# EAGLE design d2101-lofi-delay (EAGLE 7.4.1)
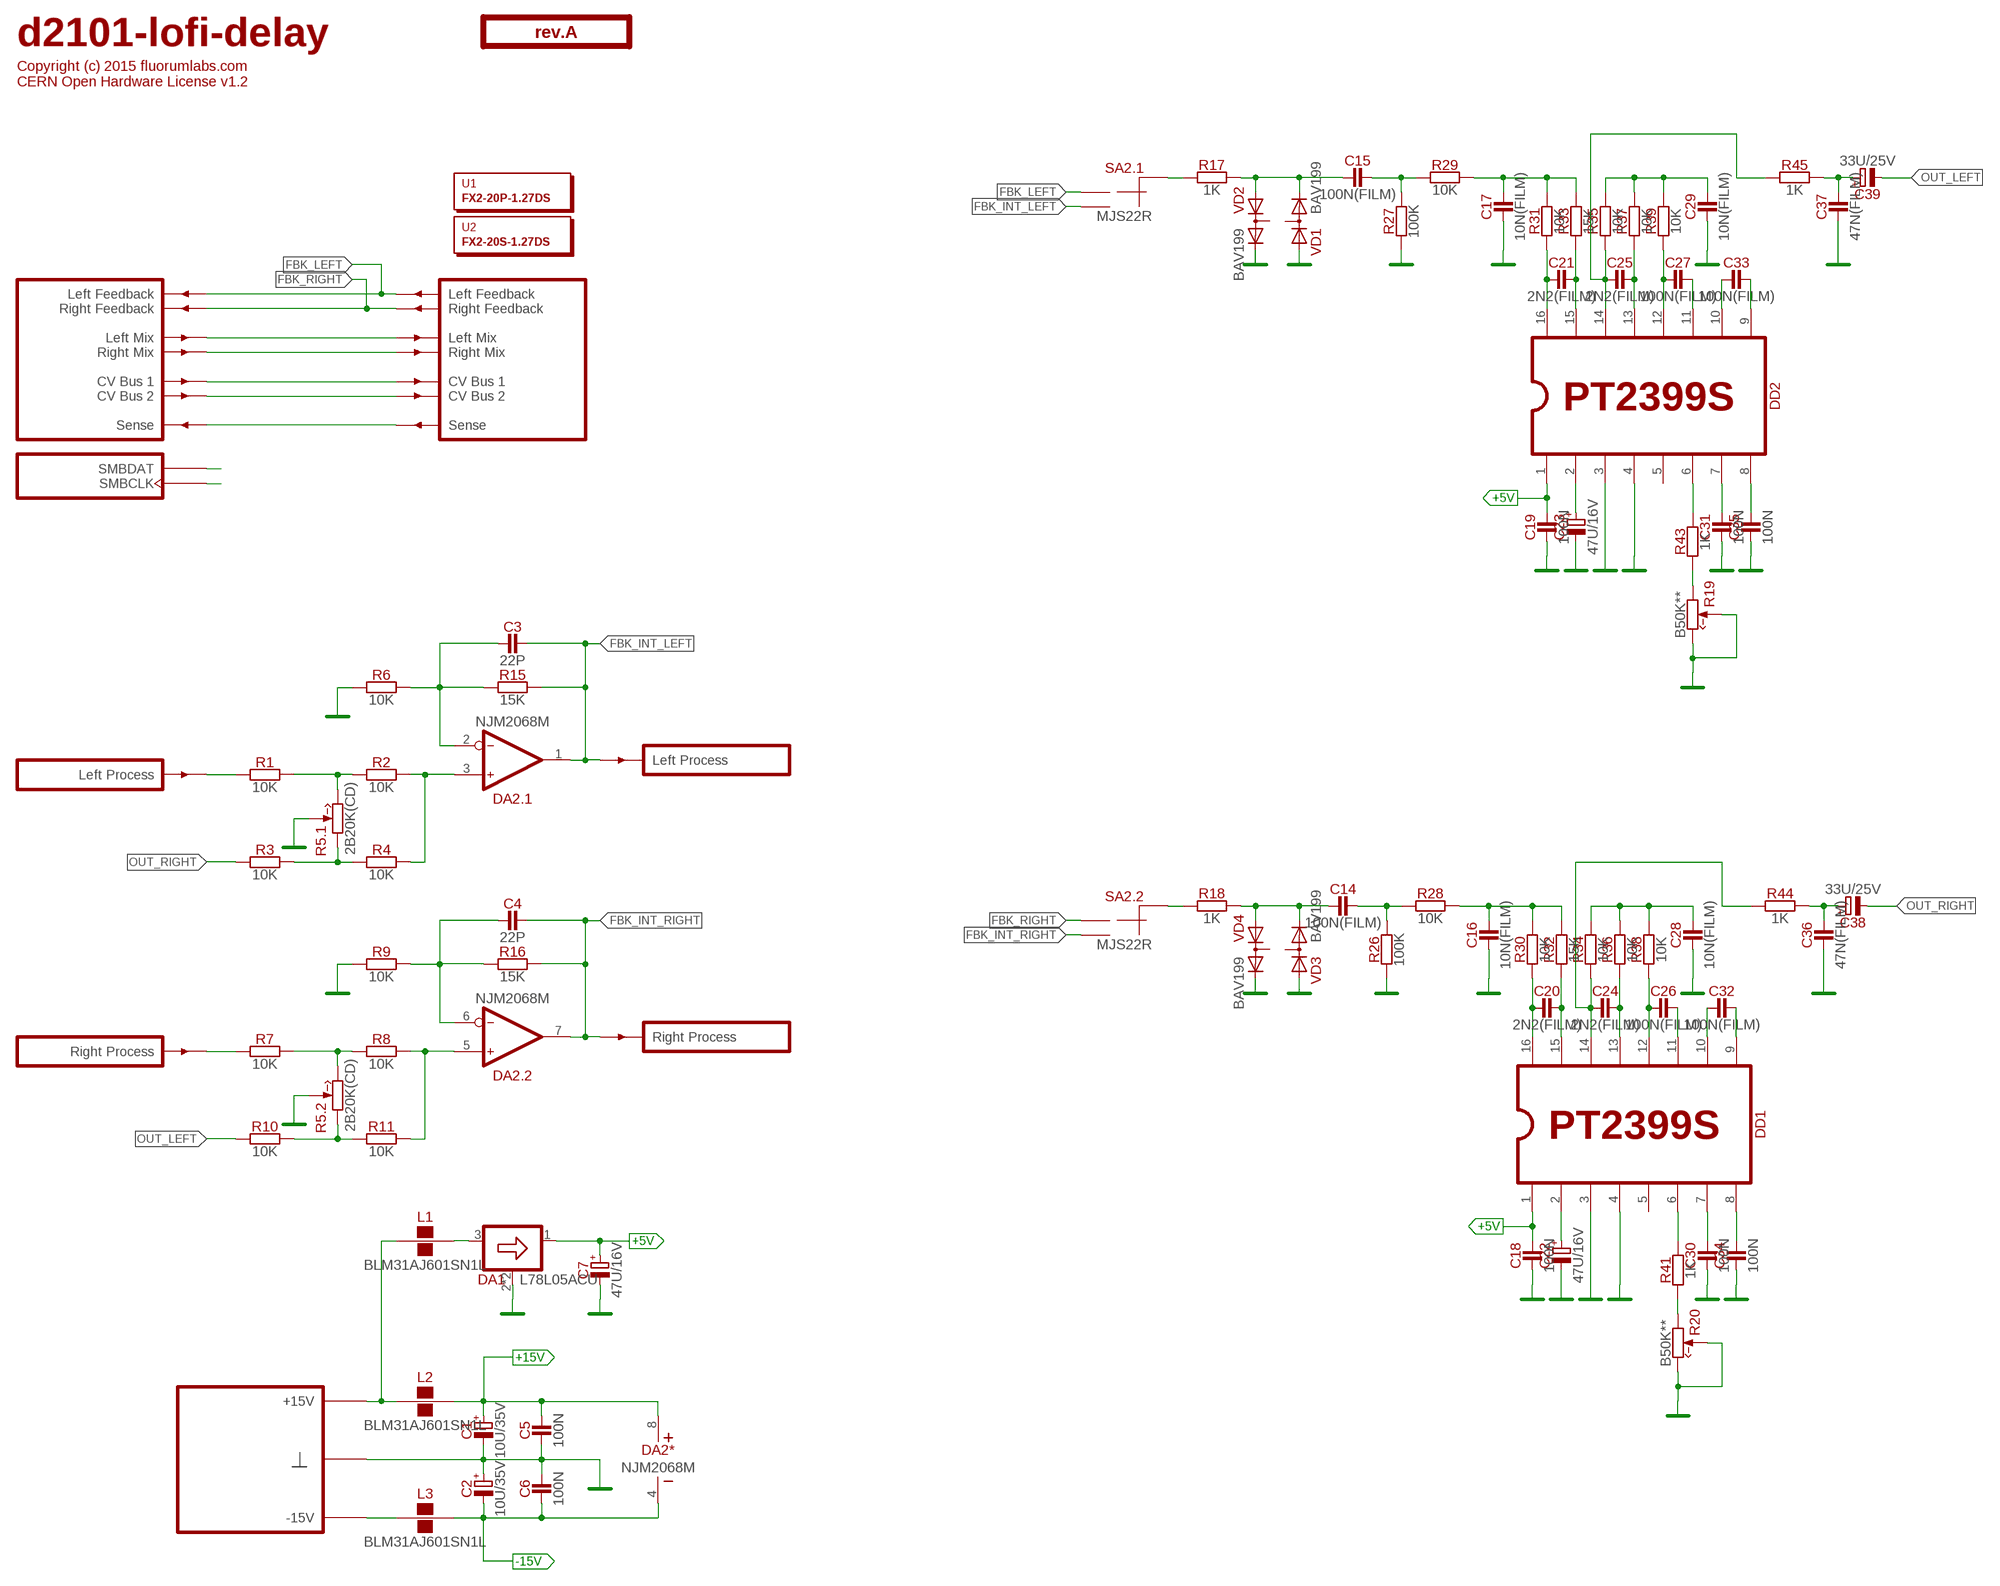
[diagram p0: schematic, sheet 1]

## Parts
C1  10U/35V  [E2-5]
C2  10U/35V  [E2-5]
C3  22P  [C-0805]
C4  22P  [C-0805]
C5  100N  [C-0805]
C6  100N  [C-0805]
C7  47U/16V  [E2-5]
C14  100N(FILM)  [C050-025X075]
C15  100N(FILM)  [C050-025X075]
C16  10N(FILM)  [C050-025X075]
C17  10N(FILM)  [C050-025X075]
C18  100N  [C-0805]
C19  100N  [C-0805]
C20  2N2(FILM)  [C050-025X075]
C21  2N2(FILM)  [C050-025X075]
C22  47U/16V  [E2-5]
C23  47U/16V  [E2-5]
C24  2N2(FILM)  [C050-025X075]
C25  2N2(FILM)  [C050-025X075]
C26  100N(FILM)  [C050-025X075]
C27  100N(FILM)  [C050-025X075]
C28  10N(FILM)  [C050-025X075]
C29  10N(FILM)  [C050-025X075]
C30  100N  [C-0805]
C31  100N  [C-0805]
C32  100N(FILM)  [C050-025X075]
C33  100N(FILM)  [C050-025X075]
C34  100N  [C-0805]
C35  100N  [C-0805]
C36  47N(FILM)  [C050-025X075]
C37  47N(FILM)  [C050-025X075]
C38  33U/25V  [E2,5-7]
C39  33U/25V  [E2,5-7]
DA1  L78L05ACU  [SOT89]
DA2  NJM2068M  [SO-8]
DD1  PT2399S  [SO-16]
DD2  PT2399S  [SO-16]
L1  BLM31AJ601SN1L  [1206]
L2  BLM31AJ601SN1L  [1206]
L3  BLM31AJ601SN1L  [1206]
O1  TITLE  [EMPTY]
PCB1  rev.A  ST2-BOARD-50  [ST2-BOARD-50]
R1  10K  [R-0805]
R2  10K  [R-0805]
R3  10K  [R-0805]
R4  10K  [R-0805]
R5  2B20K(CD)  [RV11-DUAL]
R6  10K  [R-0805]
R7  10K  [R-0805]
R8  10K  [R-0805]
R9  10K  [R-0805]
R10  10K  [R-0805]
R11  10K  [R-0805]
R15  15K  [R-0805]
R16  15K  [R-0805]
R17  1K  [R-0805]
R18  1K  [R-0805]
R19  B50K**  [RV11-SINGLE]
R20  B50K**  [RV11-SINGLE]
R26  100K  [R-0805]
R27  100K  [R-0805]
R28  10K  [R-0805]
R29  10K  [R-0805]
R30  10K  [R-0805]
R31  10K  [R-0805]
R32  15K  [R-0805]
R33  15K  [R-0805]
R34  10K  [R-0805]
R35  10K  [R-0805]
R36  10K  [R-0805]
R37  10K  [R-0805]
R38  10K  [R-0805]
R39  10K  [R-0805]
R41  1K  [R-0805]
R43  1K  [R-0805]
R44  1K  [R-0805]
R45  1K  [R-0805]
SA2  MJS22R  [APEM-MJS22R]
U1  FX2-20P-1.27DS  [EMPTY]
U2  FX2-20S-1.27DS  [EMPTY]
VD1  BAV199  [SOT23]
VD2  BAV199  [SOT23]
VD3  BAV199  [SOT23]
VD4  BAV199  [SOT23]

## Nets
+5V: C7.+ C18.2 C19.2 DA1.1(OUT) DD1.1 DD2.1
+15V [power]: C1.+ C5.2 DA2.8(*:V+) L2.2
-15V [power]: C2.- C6.1 DA2.4(*:V-) L3.2
FBK_INT_LEFT: C3.2 DA2.1(.1:OUT) PCB1.BOUTL'(OUTL) R15.2 SA2.NO1
FBK_INT_RIGHT: C4.2 DA2.7(.2:OUT) PCB1.BOUTR'(OUTR) R16.2 SA2.NO2
FBK_LEFT: PCB1.ALFBK'(LFBK') PCB1.ALFBK(LFBK) SA2.NC1
FBK_RIGHT: PCB1.ARFBK'(RFBK') PCB1.ARFBK(RFBK) SA2.NC2
GND: C1.- C2.+ C5.1 C6.2 C7.- C16.1 C17.1 C18.1 C19.1 C22.- C23.- C28.1 C29.1 C30.1 C31.1 C34.1 C35.1 C36.1 C37.1 DA1.2(GND) DA1.2@1(GND) DD1.3 DD1.4 DD2.3 DD2.4 PCB1.B4'(GND) PCB1.B4(GND) PCB1.B5'(GND) PCB1.B5(GND) PCB1.B6'(GND) PCB1.B6(GND) PCB1.B7'(GND) PCB1.B7(GND) PCB1.B8'(GND) PCB1.B8(GND) R5.2'(.2:W) R5.2(.1:W) R6.1 R9.1 R19.2(W) R19.3(CW) R20.2(W) R20.3(CW) R26.1 R27.1 VD1.1(A) VD2.2(C) VD3.1(A) VD4.2(C)
LMIX: PCB1.ALMIX'(LMIX') PCB1.ALMIX(LMIX)
N$1: R19.1(CCW) R43.1
N$2: R20.1(CCW) R41.1
N$3: C15.1 R17.2 VD1.2(C) VD2.1(A)
N$4: C21.1 DD2.16 R31.1
N$5: C14.1 R18.2 VD3.2(C) VD4.1(A)
N$6: R17.1 SA2.C1(.1:CM)
N$7: R5.3'(.2:CW) R7.2 R8.1
N$9: C15.2 R27.2 R29.1
N$10: C17.2 R29.2 R31.2 R33.2
N$11: PCB1.BINL(INL) R1.1
N$13: R18.1 SA2.C2(.2:CM)
N$15: C29.2 R35.2 R37.2 R39.2
N$16: PCB1.BSENSE'(SENSE') PCB1.BSENSE(SENSE)
N$17: C21.2 DD2.15 R33.1
N$18: C25.1 DD2.14 R35.1 R45.1
N$19: C25.2 DD2.13 R37.1
N$20: C27.1 DD2.12 R39.1
N$21: C27.2 DD2.11
N$22: C33.1 DD2.10
N$23: C33.2 DD2.9
N$24: C37.2 C39.+ R45.2
N$25: C4.1 DA2.6(.2:IN-) R9.2 R16.1
N$28: PCB1.BINR(INR) R7.1
N$30: R1.2 R2.1 R5.3(.1:CW)
N$31: C31.2 DD2.7
N$32: C35.2 DD2.8
N$33: DD2.6 R43.2
N$36: L3.1 PCB1.A-15'(P-15V) PCB1.A-15(P-15V) PCB1.B-15'(P-15V) PCB1.B-15(P-15V)
N$37: C23.+ DD2.2
N$38: PCB1.ASMBDAT'(SMBDAT) PCB1.ASMBDAT(SMBDAT)
N$39: DA2.5(.2:IN+) R8.2 R11.2
N$40: R5.1'(.2:CCW) R10.2 R11.1
N$41: PCB1.ACV1'(CV1') PCB1.ACV1(CV1)
N$42: PCB1.ACV2'(CV2') PCB1.ACV2(CV2)
N$43: PCB1.ASMBCLK'(SMBCLK) PCB1.ASMBCLK(SMBCLK)
N$44: DA1.3(IN) L1.2
N$48: C28.2 R34.2 R36.2 R38.2
N$49: C20.1 DD1.16 R30.1
N$50: C20.2 DD1.15 R32.1
N$51: C24.1 DD1.14 R34.1 R44.1
N$52: C24.2 DD1.13 R36.1
N$53: C26.1 DD1.12 R38.1
N$54: C26.2 DD1.11
N$55: C32.1 DD1.10
N$56: C32.2 DD1.9
N$57: C36.2 C38.+ R44.2
N$58: C30.2 DD1.7
N$59: C34.2 DD1.8
N$60: DD1.6 R41.2
N$61: DA2.3(.1:IN+) R2.2 R4.2
N$62: C14.2 R26.2 R28.1
N$63: C16.2 R28.2 R30.2 R32.2
N$64: C3.1 DA2.2(.1:IN-) R6.2 R15.1
N$65: R3.2 R4.1 R5.1(.1:CCW)
N$69: C22.+ DD1.2
OUT_LEFT: C39.- R10.1
OUT_RIGHT: C38.- R3.1
P+15V: L1.1 L2.1 PCB1.A+15'(P+15V) PCB1.A+15(P+15V) PCB1.B+15'(P+15V) PCB1.B+15(P+15V)
RMIX: PCB1.ARMIX'(RMIX') PCB1.ARMIX(RMIX)
Unconnected: DD1.5 DD2.5 VD1.3(CMN) VD2.3(CMN) VD3.3(CMN) VD4.3(CMN)

## Library data of the parts
C1 C2 = capacitors-electrolytic:?; MOUSER: 647-USW1V100MDD
C3 C4 = capacitors:?; MOUSER: 77-VJ0805A220GXACBC
C5 C6 C18 C19 C30 C31 C34 C35 = capacitors:?; MOUSER: 77-VJ0805V104MXBPBC
C7 C22 C23 = capacitors-electrolytic:?; MOUSER: 647-USW1C470MDD
C14 C15 C26 C27 C32 C33 = capacitors:?; MOUSER: 505-MKS2.1/63/5
C16 C17 C28 C29 = capacitors:?; MOUSER: 80-F622JF103J100C
C20 C21 C24 C25 = capacitors:?; MOUSER: 80-PHE426DJ4220JR05
C36 C37 = capacitors:?; MOUSER: 871-B32529C1473J
C38 C39 = capacitors-electrolytic:?
DA1 = regulators-linear:?; MOUSER: 511-L78L05ACU
DA2 = ic-jrc:NJM2068; MOUSER: 513-NJM2068M
DD1 DD2 = ic-princeton-technologies:PT2399; PARTNO: *
L1-L3 = inductors:BLM31AJ601SN1L; MOUSER: 81-BLM31AJ601SN1L
O1 = text:TITLE
PCB1 = module-footprints:ST2-BOARD-50
R1-R4 R6-R11 R28-R31 R34-R39 = resistors:?; MOUSER: 660-RK73H2ATTD1002F
R5 = potentiometers:2**?; MOUSER: 688-RK12L1230C1M
R15 R16 R32 R33 = resistors:?; MOUSER: 660-RK73H2ATTD1502F
R17 R18 R41 R43-R45 = resistors:?; MOUSER: 660-RK73H2ATTD1001F
R19 R20 = potentiometers:?; MOUSER: 652-PTV111-3415AB503
R26 R27 = resistors:?; MOUSER: 660-RK73H2ATTD1003F
SA2 = switches:MJS22R; MOUSER: 642-MJS22R
U1 = hardware:?; MOUSER: 798-FX2-20P-1.27DS71
U2 = hardware:?; MOUSER: 798-FX2-20S-1.27DS71
VD1-VD4 = diodes:BAV199; MOUSER: 771-BAV199-T/R

## Board
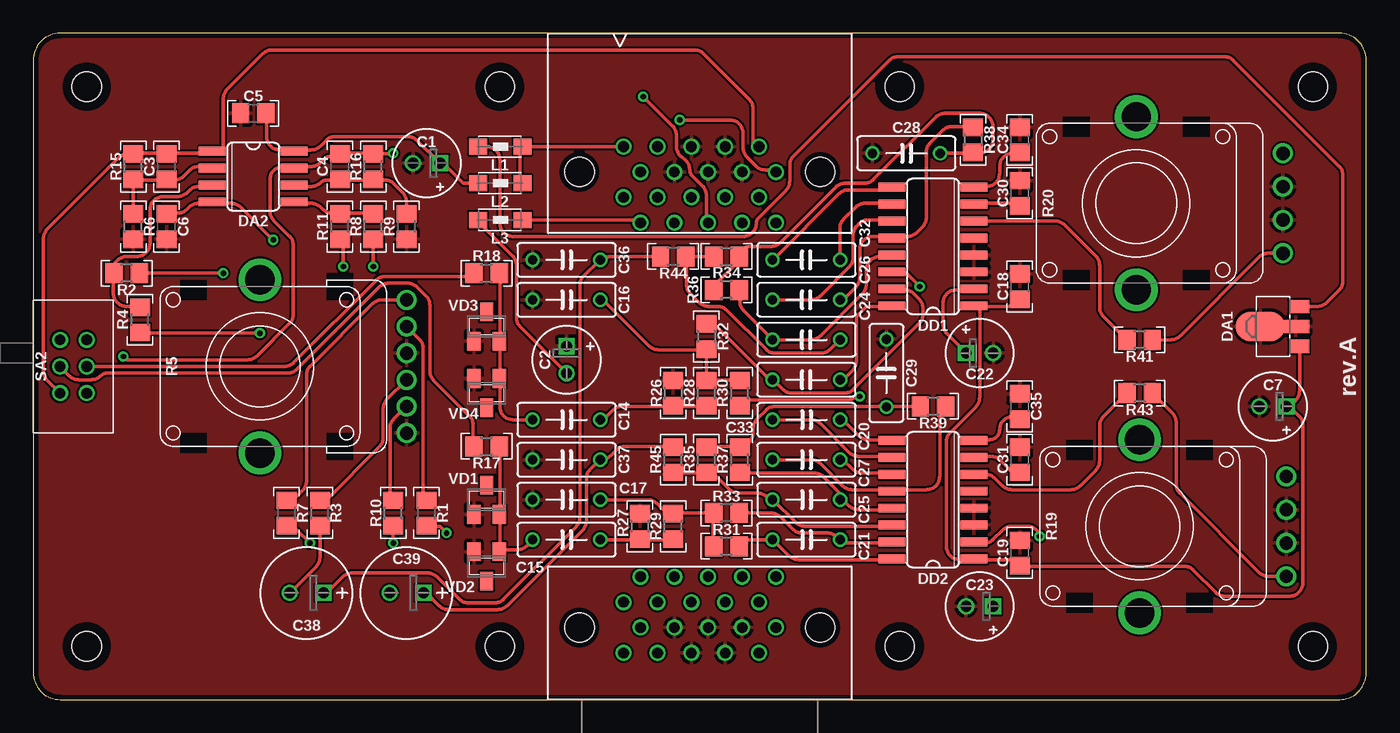
[diagram p1: board, top side]
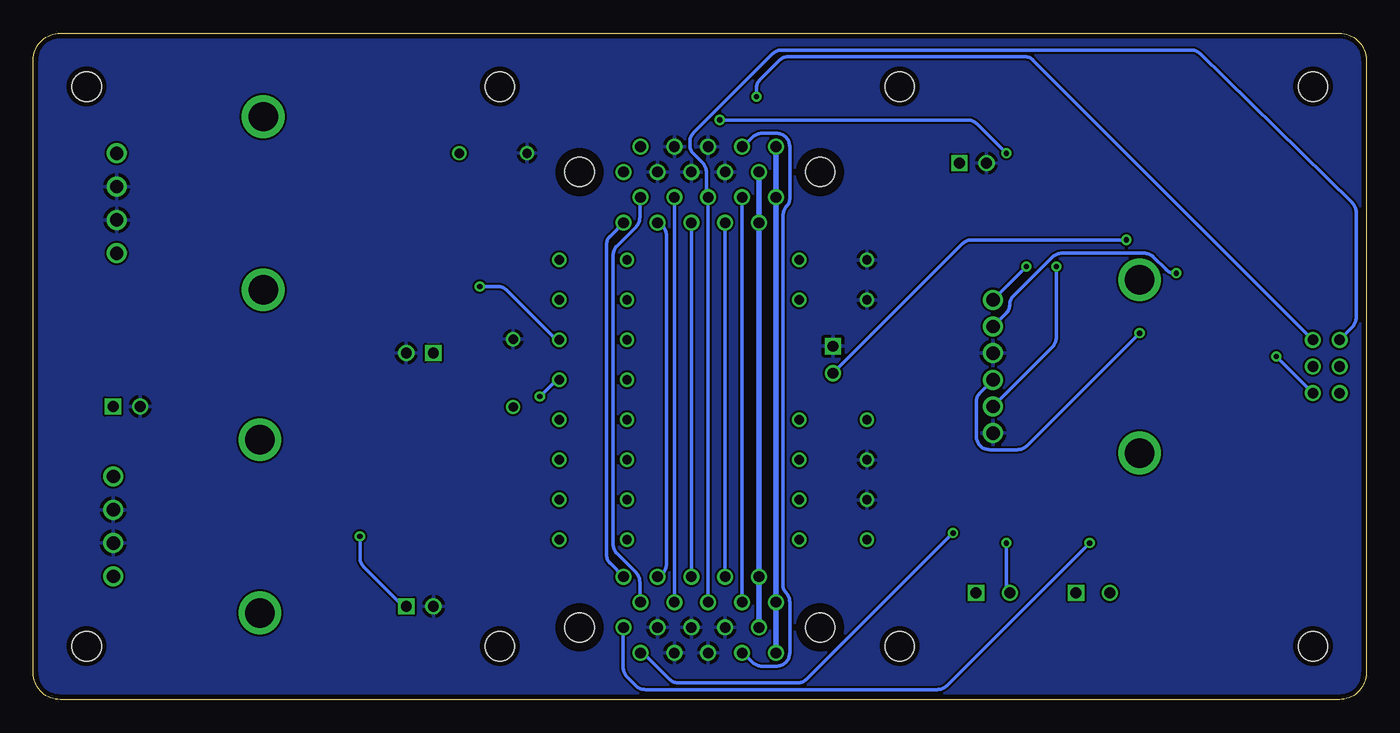
[diagram p2: board, bottom side, seen from below]

Size 100 x 50 mm. Coordinates in mm from the lower left corner, seen from the top.
Outline: 0,48 0,2 arc90 2,0 98,0 arc90 100,2 100,48 arc90 98,50 2,50 arc90 0,48
Copper layers (1*16): Top 0.0356mm / dielectric 1.5011mm / Bottom 0.0356mm
Design rules "LaenPCBOrder": minimum track width 6mil, minimum drill 13mil, track to track 6mil, track to pad 6mil, pad to pad 6mil, via to via 6mil, smd to smd 6mil, copper to edge 15mil, drill to drill 6mil, minimum pad ring 7mil, minimum via ring 7mil, stop-mask expansion 3mil, vias tented up to drill 0mil, thermal gap 10mil

### Footprints (pad centres in the part's own frame; a part is rotated, then mirrored left to right if it is on the bottom)
E2-5 = drill 0.813 square: + -1.016,0 | drill 0.813: - 1.016,0
C-0805 = smd 1.3 x 1.5: 1 -0.95,0; 2 0.95,0
C050-025X075 = drill 0.7: 1 -2.54,0; 2 2.54,0
E2,5-7 = drill 0.813 square: + -1.27,0 | drill 0.813: - 1.27,0
SOT89 = smd 1 x 1.5: 1 -1.499,-1.981; 3 1.499,-1.981 | smd 1 x 2: 2 0,-1.727 | smd 2.2 x 3.7: 2@1 0,0.94
SO-8 = smd 0.66 x 2.032: 1 -1.905,-3.073; 2 -0.635,-3.073; 3 0.635,-3.073; 4 1.905,-3.073; 5 1.905,3.073; 6 0.635,3.073; 7 -0.635,3.073; 8 -1.905,3.073
SO-16 = smd 0.66 x 2.032: 1 -4.445,-3.073; 2 -3.175,-3.073; 3 -1.905,-3.073; 4 -0.635,-3.073; 5 0.635,-3.073; 6 1.905,-3.073; 7 3.175,-3.073; 8 4.445,-3.073; 9 4.445,3.073; 10 3.175,3.073; 11 1.905,3.073; 12 0.635,3.073; 13 -0.635,3.073; 14 -1.905,3.073; 15 -3.175,3.073; 16 -4.445,3.073
1206 = smd 1.35 x 1.2: 1 -1.7,0; 2 1.65,0
ST2-BOARD-50 = drill 0.8: A+15 44.285,7.31; A+15' 44.285,37.69; A-15 45.555,9.215; A-15' 45.555,35.785; ACV1 51.905,7.31; ACV1' 51.905,37.69; ACV2 53.175,9.215; ACV2' 53.175,35.785; ALFBK 49.365,7.31; ALFBK' 49.365,37.69; ALMIX 46.825,7.31; ALMIX' 46.825,37.69; ARFBK 50.635,9.215; ARFBK' 50.635,35.785; ARMIX 48.095,9.215; ARMIX' 48.095,35.785; ASMBCLK 55.715,9.215; ASMBCLK' 55.715,35.785; ASMBDAT 54.445,7.31; ASMBDAT' 54.445,37.69; B4 48.095,5.405; B4' 48.095,39.595; B5 49.365,3.5; B5' 49.365,41.5; B6 50.635,5.405; B6' 50.635,39.595; B7 51.905,3.5; B7' 51.905,41.5; B8 53.175,5.405; B8' 53.175,39.595; B+15 44.285,3.5; B+15' 44.285,41.5; B-15 45.555,5.405; B-15' 45.555,39.595; BINL 54.445,3.5; BINR 55.715,5.405; BOUTL' 54.445,41.5; BOUTR' 55.715,39.595; BSENSE 46.825,3.5; BSENSE' 46.825,41.5 | hole 2.2: 4,4; 4,46; 96,4; 96,46; 35,46; 65,46; 65,4; 35,4; 59.025,5.405; 40.975,5.405; 40.975,39.595; 59.025,39.595
R-0805 = smd 1.3 x 1.5: 1 -0.95,0; 2 0.95,0
RV11-DUAL = drill 1: 1 -1,-11; 1' -3,-11; 2 1,-11; 2' -5,-11; 3 3,-11; 3' 5,-11 | drill 2.2: S1 -6.5,0; S2 6.5,0
RV11-SINGLE = drill 1: 1 -3.75,-11; 2 -1.25,-11; 3 1.25,-11; 4 3.75,-11 | drill 2.2: S1 -6.5,0; S2 6.5,0
APEM-MJS22R = drill 0.8: C1 0,-2; C2 0,-4; NC1 2,-2; NC2 2,-4; NO1 -2,-2; NO2 -2,-4
SOT23 = smd 1 x 1.4: 1 -0.95,-1.1; 2 0.95,-1.1; 3 0,1.1

### Placement (x,y rotation side)
C1  29.5,40.25 180 top
C2  40,25.5 270 top
C3  10,40 90 top
C4  23,40 90 top
C5  16.5,44 0 top
C6  10,35.5 270 top
C7  10U/35V  [E2-5]  93,22 180 top
C14  40,21 0 top
C15  40,12 0 top
C16  40,30 0 top
C17  40,15 0 top
C18  74,31 270 top
C19  74,11 270 top
C20  58,24 180 top
C21  58,12 0 top
C22  10U/35V  [E2-5]  71,26 0 top
C23  10U/35V  [E2-5]  71,7 180 top
C24  58,27 180 top
C25  58,15 0 top
C26  58,30 180 top
C27  58,18 0 top
C28  65.5,41 0 top
C29  64,24.5 270 top
C30  74,38 270 top
C31  74,18 270 top
C32  58,33 180 top
C33  58,21 0 top
C34  74,42 270 top
C35  74,22 270 top
C36  40,33 0 top
C37  40,18 0 top
C38  20.5,8 180 top
C39  28,8 180 top
DA1  93,28 90 top
DA2  16.5,39.25 270 top
DD1  67.5,34 90 top
DD2  67.5,15 90 top
L1  35,41.5 180 top
L2  35,38.75 180 top
L3  35,36 180 top
O1  -39.37,99.06 0 top  (outside the outline)
PCB1  0,0 0 top
R1  29.5,14 90 top
R2  7,32 180 top
R3  21.5,14 90 top
R4  8,28.5 90 top
R5  2*B20K(CD)  [RV11-DUAL]  17,25 90 top
R6  7.5,35.5 90 top
R7  19,14 90 top
R8  25.5,35.5 90 top
R9  28,35.5 90 top
R10  27,14 90 top
R11  23,35.5 90 top
R15  7.5,40 90 top
R16  25.5,40 90 top
R17  34,19 0 top
R18  34,32 0 top
R19  83,13 90 top
R20  82.75,37.25 90 top
R26  48,23 270 top
R27  45.5,13 270 top
R28  50.5,23 90 top
R29  48,13 90 top
R30  53,23 90 top
R31  52,11.5 180 top
R32  50.5,27.25 270 top
R33  52,14 180 top
R34  52,33.25 0 top
R35  50.5,18 90 top
R36  52,30.75 180 top
R37  53,18 90 top
R38  70.5,42 270 top
R39  67.5,22 180 top
R41  83,27 180 top
R43  83,23 180 top
R44  48,33.25 180 top
R45  48,18 90 top
SA2  0,25 90 top
U1  -60,-7 0 top  (outside the outline)
U2  -61,-9 0 top  (outside the outline)
VD1  34,15 0 top
VD2  34,10 180 top
VD3  34,28 0 top
VD4  34,23 180 top

### Tracks (layer width: path | path; a pad name or v marks a point on that pad's centre or on a via)
+5V
  Top 0.254: 74,10 73.5,10.5 70.75,10.5 DD2.1 70.5,10.5 69.5,10.5 arc-90 68.5,11.5 68.5,19.34 arc-45 68.79,20.04 70.71,21.96 arc45 71,22.66 71,29.5 | 71,29.5 70.75,29.5 DD1.1 71,29.5 | 71,29.5 73.09,29.5 arc45 73.79,29.79 74,30 C18.2 | 94.25,22 94.71,22.46 arc45 95,23.16 95,26.5 DA1.1 | 94.25,22 94.96,21.29 arc-45 95.25,20.59 95.25,8.75 arc-90 94.25,7.75 89.41,7.75 arc-45 88.71,8.04 87.04,9.71 arc45 86.34,10 74,10 | 74,10 C19.2 | 94.25,22 C7.+
+15V
  Top 0.254: 33.5,38.75 L2.2 32.25,38.75 30.75,40.25 C1.+ 30.5,40.25 28.79,41.96 arc45 28.09,42.25 22.66,42.25 arc45 21.96,41.96 21.54,41.54 arc-45 20.84,41.25 19.75,41.25 DA2.8 19.5,41.25 18.5,41.25 arc-90 17.5,42.25 17.5,44 C5.2
-15V  (via drill 0.4)
  Top 0.254: C6.1 10,36.5 10.84,36.5 arc45 11.54,36.79 11.71,36.96 arc-45 12.41,37.25 13.25,37.25 DA2.4 13.5,37.25 14.84,37.25 arc-45 15.54,36.96 v18,34.5 | L3.2 33.25,36 35.96,33.29 arc-45 36.25,32.59 36.25,28.66 arc45 36.54,27.96 40,24.5 C2.-
  Bottom 0.254: v18,34.5 29.59,34.5 arc-45 30.29,34.21 40,24.5 C2.-
FBK_INT_LEFT
  Top 0.254: 7.5,41 10,41 | 10,41 12.5,41 12.75,41.25 13.25,41.25 DA2.1 13.5,41.25 14,41.25 14.25,41.5 14.25,45.09 arc-45 14.54,45.79 17.21,48.46 arc-45 17.91,48.75 49.59,48.75 arc-45 50.29,48.46 53.71,45.04 arc-45 54,44.34 54,41.75 54.25,41.5 PCB1.BOUTL' | 10,41 C3.2 | SA2.NO1 1.04,23.96 arc-45 0.75,24.66 0.75,34.59 arc-45 1.04,35.29 6.46,40.71 arc-45 7.16,41 7.5,41 | 7.5,41 R15.2
FBK_INT_RIGHT  (via drill 0.4)
  Top 0.254: v6.75,25.75 7,25.5 16.09,25.5 arc45 16.79,25.79 19.21,28.21 arc45 19.5,28.91 19.5,34.09 arc45 19.21,34.79 18.04,35.96 arc-45 17.75,36.66 17.75,39 arc-90 18.75,40 19.5,40 DA2.7 19.75,40 20.84,40 arc45 21.54,40.29 21.82,40.57 arc-45 22.25,40.75 22.5,41 23,41 | 23,41 25.5,41 R16.2 26.95,40.95 v27,41 | 23,41 C4.2 | v48.5,43.5 52.25,43.5 arc-90 53.25,42.5 53.25,41.41 arc45 53.54,40.71 54.21,40.04 arc45 54.91,39.75 55.5,39.75 PCB1.BOUTR'
  Bottom 0.254: SA2.NO2 v6.75,25.75 | v48.5,43.5 29.91,43.5 arc45 29.21,43.21 v27,41
FBK_LEFT
  Bottom 0.254: PCB1.ALFBK PCB1.ALFBK' 49.5,37.75 49.5,39.59 arc-45 49.79,40.29 50.46,40.96 arc45 50.75,41.66 50.75,41.84 arc45 50.46,42.54 44.54,48.46 arc45 43.84,48.75 13.16,48.75 arc44 12.46,48.47 1.05,37.29 arc46 0.75,36.58 0.75,28.66 arc45 1.04,27.96 SA2.NC1
FBK_RIGHT  (via drill 0.4)
  Top 0.254: v45.75,45.25 47.96,43.04 arc-45 48.25,42.34 48.25,41.5 arc53 48.65,40.7 48.85,40.55 arc-53 49.25,39.75 arc45 49.43,39.32 50.21,38.54 arc-45 50.5,37.84 50.5,36 PCB1.ARFBK'
  Bottom 0.254: PCB1.ARFBK' PCB1.ARFBK | SA2.NC2 24.96,47.96 arc-45 25.66,48.25 43.34,48.25 arc-45 44.04,47.96 45.46,46.54 arc-45 45.75,45.84 v45.75,45.25
GND
  pour Bottom: 0,50 100,50 100,0 0,0
  pour Top: 0,50 100,50 100,0 0,0
LMIX
  Bottom 0.254: PCB1.ALMIX PCB1.ALMIX'
N$1
  Top 0.254: R19.1 92.66,9.25 arc-45 91.96,9.54 86.04,15.46 arc-45 85.75,16.16 85.75,20.79 arc45 85.46,21.49 R43.1
N$2
  Top 0.254: R20.1 92.66,33.5 arc45 91.96,33.21 86.04,27.29 arc-45 85.34,27 R41.1
N$3
  Top 0.254: R17.2 35,19 35,14 VD1.2 35,13.75 35,11.25 | 35,11.25 36.34,11.25 arc45 37.04,11.54 37.5,12 C15.1 | 35,11.25 VD2.1
N$4
  Top 0.254: DD2.16 64.25,10.5 57.41,10.5 arc-45 56.71,10.79 55.5,12 C21.1 53.25,12 52.75,11.5 R31.1
N$5
  Top 0.254: R18.2 35,32 35,27 VD3.2 35,26.75 35,24.25 VD4.1 35,24 35,22 arc90 36,21 C14.1
N$6
  Top 0.254: SA2.C1 2.71,24.29 arc45 3.41,24 4.34,24 arc45 5.04,24.29 arc-45 5.54,24.5 19.09,24.5 arc45 19.79,24.79 25.96,30.96 arc-45 26.66,31.25 28.09,31.25 arc-45 28.79,30.96 29.46,30.29 arc-45 29.75,29.59 29.75,24.66 arc45 30.04,23.96 32.71,21.29 arc-45 33,20.59 33,19 R17.1
N$7  (via drill 0.4)
  Top 0.254: R8.1 v25.5,32.5 | R5.3' 26.16,30 arc45 25.46,29.71 20.79,25.04 arc45 20.5,24.34 20.5,16.41 arc-45 20.21,15.71 19.5,15 19,15 R7.2
  Bottom 0.254: R5.3' v25.5,32.5
N$9
  Top 0.254: 45.5,12 48,12 R29.1 | 45.5,12 C15.2 | 45.5,12 R27.2
N$10
  Top 0.254: 48,14 51,14 | 51,14 R33.2 | 51,14 51,11.5 R31.2 | C17.2 46.09,15 arc-45 46.79,14.71 47.5,14 48,14 | 48,14 R29.2
N$11  (via drill 0.4)
  Top 0.254: v31,12.5 30.5,13 29.5,13 R1.1
  Bottom 0.254: v31,12.5 41.96,1.54 arc45 42.66,1.25 51.59,1.25 arc45 52.29,1.54 54.25,3.5 PCB1.BINL
N$13
  Top 0.254: R18.1 33.25,32 33,31.75 26.41,31.75 arc45 25.71,31.46 19.54,25.29 arc-45 18.84,25 SA2.C2
N$15
  Top 0.254: 53,19 50.5,19 R35.2 | R39.2 64,22 | 64,22 55.66,22 arc45 54.96,21.71 54.29,21.04 arc45 54,20.34 54,20 arc-90 53,19 | 53,19 R37.2 | 64,22 C29.2
N$16
  Bottom 0.254: PCB1.BSENSE' 46.75,41.5 46.04,42.21 arc45 45.34,42.5 44.25,42.5 arc90 43.25,41.5 43.25,37.54 arc45 43.46,37.04 arc-45 43.75,36.34 43.75,8.54 arc-45 43.54,8.04 arc45 43.25,7.34 43.25,3.5 arc90 44.25,2.5 45.34,2.5 arc45 46.04,2.79 46.75,3.5 PCB1.BSENSE
N$17
  Top 0.254: DD2.15 64.25,11.75 61,11.75 60.75,12 C21.2 60.5,12 60.29,12.21 arc45 59.59,12.5 57.66,12.5 arc-45 56.96,12.79 56.04,13.71 arc45 55.34,14 R33.1
N$18
  Top 0.254: R45.1 48,17 50.5,17 | DD2.14 64.25,13 57.91,13 arc-45 57.21,13.29 55.5,15 C25.1 55.25,15 55.04,15.21 arc45 54.34,15.5 52.91,15.5 arc-45 52.21,15.79 51,17 50.5,17 | 50.5,17 R35.1
N$19
  Top 0.254: 60.75,15 61.21,14.54 arc45 61.91,14.25 64.25,14.25 DD2.13 | 60.75,15 60.75,15.25 59.29,16.71 arc45 58.59,17 53,17 R37.1 | 60.75,15 C25.2
N$20
  Top 0.254: C27.1 58.34,18 arc-45 59.04,17.71 60.71,16.04 arc45 61.41,15.75 64.25,15.75 DD2.12 64.5,15.75 67,15.75 arc90 68,16.75 68,21.5 68.5,22 R39.1
N$21
  Top 0.254: DD2.11 64.25,17 62.16,17 arc-45 61.46,17.29 60.75,18 C27.2
N$22
  Top 0.254: DD2.10 64.25,18.25 61.91,18.25 arc-45 61.21,18.54 59.04,20.71 arc45 58.34,21 C33.1
N$23
  Top 0.254: DD2.9 64.25,19.5 62.66,19.5 arc-45 61.96,19.79 60.75,21 C33.2
N$24
  Top 0.254: R45.2 48,19 44.41,19 arc45 43.71,18.71 43.29,18.29 arc-45 42.59,18 C37.2 42.5,18 41.79,17.29 arc45 41.5,16.59 41.5,13.41 arc-45 41.21,12.71 35.54,7.04 arc-45 34.84,6.75 31.16,6.75 arc-45 30.46,7.04 29.5,8 C39.+
N$25
  Top 0.254: 23,39 25.5,39 | 23,39 22.04,39 arc45 21.54,38.79 arc-45 20.84,38.5 19.75,38.5 DA2.6 | 23,39 C4.1 | R9.2 28,37.34 arc45 27.71,38.04 27.04,38.71 arc45 26.34,39 25.5,39 | 25.5,39 R16.1
N$28  (via drill 0.4)
  Top 0.254: v20.75,11.75 19.79,12.71 arc45 19.09,13 19,13 R7.1
  Bottom 0.254: v20.75,11.75 31.46,1.04 arc45 32.16,0.75 54.09,0.75 arc45 54.79,1.04 55.46,1.71 arc45 55.75,2.41 55.75,5.25 PCB1.BINR
N$30  (via drill 0.4)
  Top 0.254: v14.25,32 R2.1 | R1.2 29.5,14.75 29.25,15 29.25,26.34 arc45 28.96,27.04 R5.3
  Bottom 0.254: R5.3 26.99,29.01 arc-45 26.75,29.59 arc45 26.46,30.29 23.54,33.21 arc45 22.84,33.5 16.66,33.5 arc45 15.96,33.21 15.04,32.29 arc-45 14.34,32 v14.25,32
N$31
  Top 0.254: C31.2 74,17 73.5,17 72.54,17.96 arc45 71.84,18.25 70.75,18.25 DD2.7
N$32
  Top 0.254: C35.2 74,21.25 73.5,21.25 arc90 72.5,20.25 arc-90 71.75,19.5 70.75,19.5 DD2.8
N$33
  Top 0.254: DD2.6 71.43,16.91 arc-45 72.14,16.61 72.71,16.04 arc45 73.41,15.75 77.84,15.75 arc45 78.54,16.04 79.71,17.21 arc45 80,17.91 80,20.54 arc-45 80.29,21.24 R43.2
N$36
  Top 0.254: L3.1 45.28,36 arc-76 PCB1.A-15'
  Bottom 0.406: PCB1.B-15' PCB1.A-15' PCB1.A-15 PCB1.B-15
N$37  (via drill 0.4)
  Top 0.254: v75.5,12.25 75.5,12.5 75.29,12.71 arc45 74.59,13 73.41,13 arc45 72.71,12.71 72.04,12.04 arc-45 71.34,11.75 70.75,11.75 DD2.2
  Bottom 0.254: v75.5,12.25 75.5,10.66 arc-45 75.21,9.96 72.25,7 C23.+
N$38
  Bottom 0.254: PCB1.ASMBDAT' 54.5,37.5 54.5,36.16 arc45 54.79,35.46 56.21,34.04 arc-45 56.5,33.34 56.5,11.66 arc-45 56.21,10.96 54.79,9.54 arc45 54.5,8.84 54.5,7.5 PCB1.ASMBDAT
N$39
  Top 0.254: 23,36.5 25.5,36.5 R8.2 | 23,36.5 22.41,36.5 arc-45 21.71,36.79 21.54,36.96 arc45 20.84,37.25 19.75,37.25 DA2.5 | 23,36.5 R11.2
N$40  (via drill 0.4)
  Top 0.254: v23.25,32.5 23.25,34.5 23,34.75 R11.1 | R10.2 27,14.75 26.75,15 26.75,20.34 arc-45 27.04,21.04 R5.1'
  Bottom 0.254: R5.1' 23.54,26.46 arc-45 23.25,27.16 v23.25,32.5
N$41
  Bottom 0.254: PCB1.ACV1 PCB1.ACV1'
N$42
  Bottom 0.254: PCB1.ACV2' 53,35.75 52.79,35.54 arc45 52.5,34.84 52.5,10.16 arc45 52.79,9.46 53,9.25 PCB1.ACV2
N$43
  Bottom 0.254: PCB1.ASMBCLK 56.71,10.21 arc45 57,10.91 57,34.09 arc45 56.71,34.79 PCB1.ASMBCLK'
N$44
  Top 0.254: DA1.3 95,29.5 96.34,29.5 arc45 97.04,29.79 97.96,30.71 arc45 98.25,31.41 98.25,39.34 arc45 97.96,40.04 90.04,47.96 arc45 89.34,48.25 64.91,48.25 arc45 64.21,47.96 57.04,40.79 arc45 56.75,40.09 56.75,38.91 arc-45 56.46,38.21 54.43,36.18 arc45 54.25,35.75 arc-90 53.25,34.75 36,34.75 arc-90 35,35.75 35,40.5 arc90 34,41.5 L1.2
N$48
  Top 0.254: 70.5,41 C28.2 | 70.5,41 71,41 arc90 72,42 72,43 arc90 71,44 68.41,44 arc45 67.71,43.71 63.04,39.04 arc-45 62.34,38.75 60.91,38.75 arc45 60.21,38.46 56.04,34.29 arc-45 55.34,34 53.75,34 arc90 53,33.25 | 70.5,41 R38.2 | 53,33.25 53,33 51,31 R36.2 | 53,33.25 R34.2
N$49  (via drill 0.4)
  Top 0.254: v62,22.75 61.75,22.75 arc-45 61.15,22.5 53.5,22.5 53,22 R30.1 | C20.1 60.75,24 61.46,24.71 arc45 61.75,25.41 61.75,28.75 62.5,29.5 64.25,29.5 DD1.16
  Bottom 0.254: v62,22.75 60.75,24 C20.1
N$50
  Top 0.254: DD1.15 64.5,30.75 65.34,30.75 arc-45 66.04,30.46 66.46,30.04 arc-45 66.75,29.34 66.75,28.91 arc-45 66.46,28.21 61.54,23.29 arc-45 60.84,23 56.91,23 arc-45 56.21,23.29 55.5,24 C20.2 55.25,24 51,28.25 50.5,28.25 R32.1
N$51  (via drill 0.4)
  Top 0.254: v66.5,31 65.5,32 64.5,32 DD1.14 | 49,33.25 R34.1 | 49,33.25 49,31.5 49,31.41 49,31.16 arc45 49.29,30.46 49.96,29.79 arc45 50.66,29.5 50.91,29.5 51,29.5 51.34,29.5 arc-45 52.04,29.21 54.96,26.29 arc45 55.66,26 59.09,26 arc45 59.79,26.29 60.5,27 C24.1 | 49,33.25 R44.1
  Bottom 0.254: C24.1 60.75,27 64.46,30.71 arc-45 65.16,31 v66.5,31 66.75,31
N$52
  Top 0.254: DD1.13 64.25,33.25 63.5,33.25 arc90 62.5,32.25 62.5,31.16 arc-45 62.21,30.46 59.04,27.29 arc-45 58.34,27 55.5,27 | 53,31 R36.1 53,30.75 53,29.91 arc45 53.29,29.21 55.5,27 | 55.5,27 C24.2
N$53
  Top 0.254: C26.1 60.75,30 61.71,30.96 arc45 62,31.66 62,33.75 arc-90 63,34.75 64.25,34.75 DD1.12 64.5,34.75 65.59,34.75 arc45 66.29,35.04 66.71,35.46 arc45 67,36.16 67,41.09 arc-45 67.29,41.79 68.21,42.71 arc-45 68.91,43 70.5,43 R38.1
N$54
  Top 0.254: DD1.11 64.25,36 62.66,36 arc45 61.96,35.71 61.79,35.54 arc45 61.5,34.84 61.5,33.16 arc-45 61.21,32.46 59.04,30.29 arc-45 58.34,30 C26.2
N$55
  Top 0.254: DD1.10 64.25,37.25 62.41,37.25 arc45 61.71,36.96 60.79,36.04 arc45 60.5,35.34 60.5,33 C32.1
N$56
  Top 0.254: DD1.9 64.25,38.5 63.75,38.5 63.5,38.25 61.16,38.25 arc45 60.46,37.96 55.5,33 C32.2
N$57
  Top 0.254: R44.2 43.35,33.25 arc45 42.75,33 C36.2 42.5,33 41.29,31.79 arc45 41,31.09 41,13.66 arc-45 40.71,12.96 35.29,7.54 arc-45 34.59,7.25 32.66,7.25 arc-45 31.96,7.54 30.29,9.21 arc45 29.59,9.5 23.91,9.5 arc45 23.21,9.21 22,8 C38.+
N$58
  Top 0.254: C30.2 74,37 73.5,37 73.25,37.25 70.75,37.25 DD1.7
N$59
  Top 0.254: DD1.8 70.75,38.5 71.5,38.5 arc90 72.5,39.5 72.5,40 arc-90 73.5,41 74,41 C34.2
N$60
  Top 0.254: DD1.6 76.68,35.91 arc-45 77.39,35.61 79.71,33.29 arc-45 80,32.59 80,29.46 arc45 80.29,28.76 R41.2
N$61
  Top 0.254: 6,32 6,32.25 arc-90 7,33.25 7.75,33.25 arc90 8.75,34.25 8.75,36.75 arc-90 9.75,37.75 10.84,37.75 arc45 11.54,38.04 11.71,38.21 arc-45 12.41,38.5 13.25,38.5 DA2.3 | 6,32 6,30.5 arc90 7,29.5 8,29.5 R4.2 | 6,32 R2.2
N$62
  Top 0.254: 48,22 50.5,22 R28.1 | C14.2 arc45 42.9,21.15 43.46,21.71 arc-45 44.16,22 48,22 | 48,22 R26.2
N$63
  Top 0.254: 50.5,24 50.5,26.25 | R30.2 53,24 50.5,24 | 50.5,24 R28.2 | 50.5,26.25 R32.2 | 50.5,26.25 46.91,26.25 arc-45 46.21,26.54 42.75,30 C16.2
N$64
  Top 0.254: 10,39 10.59,39 arc45 11.29,39.29 11.71,39.71 arc-45 12.41,40 13.25,40 DA2.2 | 10,39 7.5,39 | 10,39 C3.1 | 7.5,39 R15.1 | R6.2 7.5,39
N$65  (via drill 0.4)
  Top 0.254: R3.2 21.5,15 22,15 25.96,18.96 arc45 26.25,19.66 26.25,21.84 arc-45 26.54,22.54 R5.1 | v17,27.5 8,27.5 R4.1
  Bottom 0.254: v17,27.5 25.46,19.04 arc45 26.16,18.75 28.25,18.75 arc90 29.25,19.75 29.25,22.34 arc45 28.96,23.04 R5.1
N$69
  Top 0.254: C22.+ 70,26 68.54,27.46 arc-45 68.25,28.16 68.25,29.75 arc-90 69.25,30.75 70.5,30.75 DD1.2
OUT_LEFT  (via drill 0.4)
  Top 0.254: R10.1 v27,11.75
  Bottom 0.254: v27,11.75 27,8.6 arc-45 26.75,8 C39.-
OUT_RIGHT
  Top 0.254: R3.1 21.5,10.66 arc-45 21.21,9.96 19.25,8 C38.-
P+15V
  Top 0.254: L2.1 36.5,38.75 36.5,41.5 | 36.5,41.5 L1.1 | PCB1.B+15' 36.5,41.5
  Bottom 0.406: PCB1.B+15 PCB1.A+15 PCB1.A+15' PCB1.B+15'
RMIX
  Bottom 0.254: PCB1.ARMIX' PCB1.ARMIX